# EAGLE schematic DC28_Jack-Attack_Badge-3 (EAGLE 9.5.1)
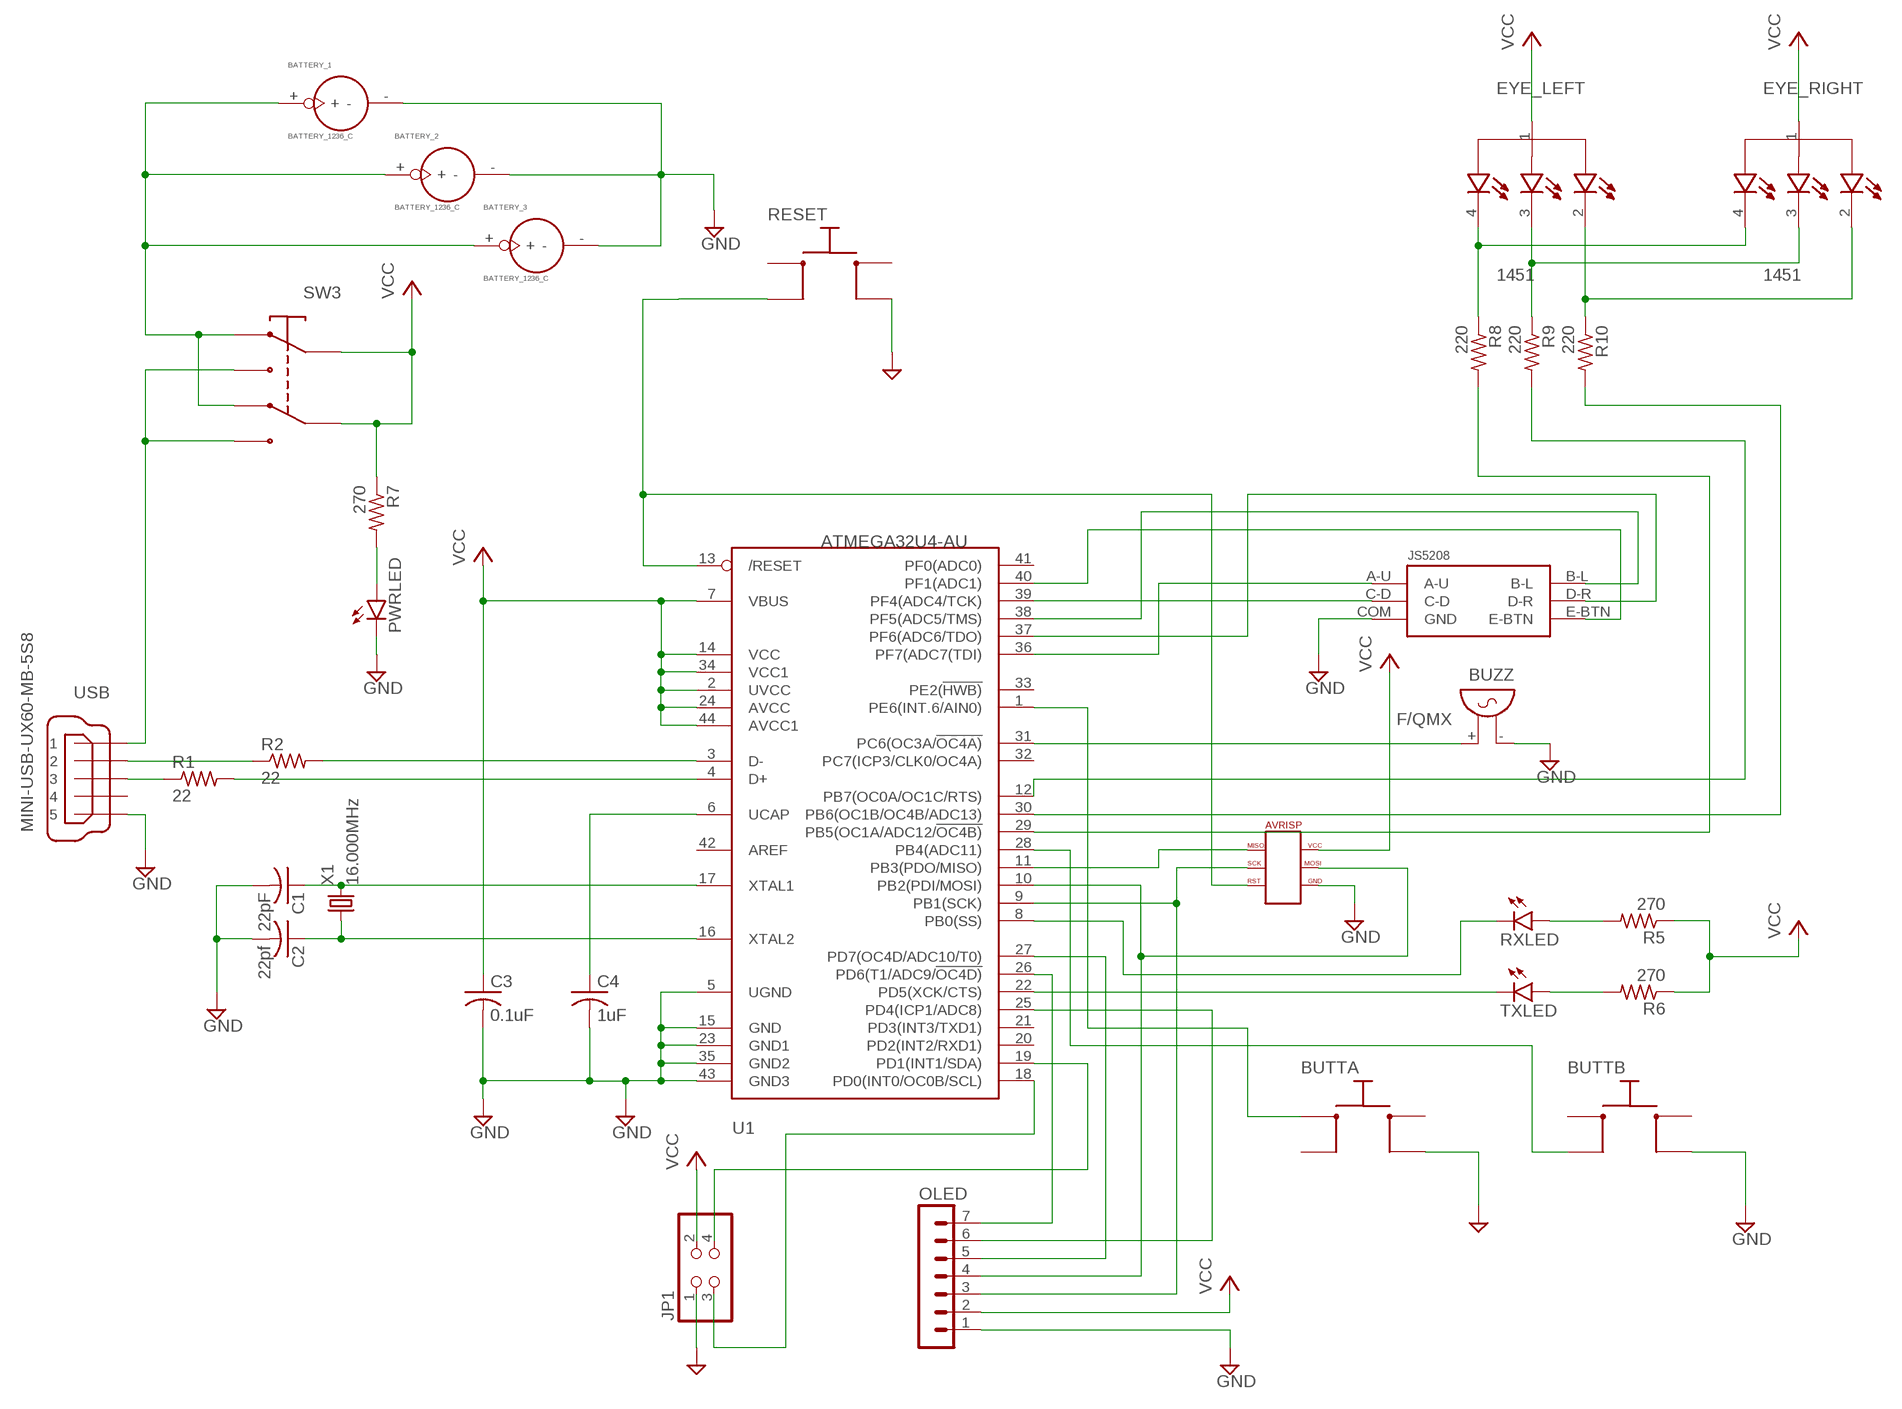
[diagram p0: schematic, sheet 1]

## Parts
BATTERY_1  BATTERY_1236_C  [BATTERY_1236_C]
BATTERY_2  BATTERY_1236_C  [BATTERY_1236_C]
BATTERY_3  BATTERY_1236_C  [BATTERY_1236_C]
BUTTA  PTS645  [PTS645_SMD]
BUTTB  PTS645  [PTS645_SMD]
BUZZ  F/QMX  [F/QMX]
C1  22pF  C-USC0805  [C0805]
C2  22pf  C-USC0805  [C0805]
C3  0.1uF  C-USC0805  [C0805]
C4  1uF  C-USC0805  [C0805]
EYE_LEFT  1451  [LED_1451]
EYE_RIGHT  1451  [LED_1451]
JP1  PINHD-2X2  [2X02]
OLED  MA07-1  [MA07-1]
PWRLED  LEDCHIP-LED0805  [CHIP-LED0805]
R1  22  R-US_R0805  [R0805]
R2  22  R-US_R0805  [R0805]
R5  270  R-US_R0805  [R0805]
R6  270  R-US_R0805  [R0805]
R7  270  R-US_R0805  [R0805]
R8  220  R-US_R0805  [R0805]
R9  220  R-US_R0805  [R0805]
R10  220  R-US_R0805  [R0805]
RESET  PTS645  [PTS645_SMD]
RXLED  LEDCHIP-LED0805  [CHIP-LED0805]
SW3  JS202011AQN  [JS202011AQN]
TXLED  LEDCHIP-LED0805  [CHIP-LED0805]
U1  ATMEGA32U4-AU  [TQFP44]
U$1  AVRISP_POGO  [AVRISP_POGO]
U$2  JS5208  [JS5208_PKG]
USB  MINI-USB-UX60-MB-5S8  [UX60-MB-5S8]
X1  16.000MHz  CSM-7X-DU  [CSM-7X-DU]

## Nets
BATT1: BATTERY_1.+ BATTERY_2.+ BATTERY_3.+ SW3.P$1 SW3.P$4
GND: BATTERY_1.- BATTERY_2.- BATTERY_3.- BUTTA.P$4 BUTTB.P$4 BUZZ.- C1.2 C2.2 C3.2 C4.2 JP1.1 OLED.1 PWRLED.C RESET.P$4 U1.5(UGND) U1.15(GND) U1.23(GND1) U1.35(GND2) U1.43(GND3) U$1.P$6 U$1.P$6B U$2.COM(GND) USB.5
N$1: R1.1 USB.3
N$2: R2.2 U1.3(D-)
N$3: R2.1 USB.2
N$4: R1.2 U1.4(D+)
N$5: C4.1 U1.6(UCAP)
N$6: BUTTA.P$1 U1.1(PE6(INT.6/AIN0))
N$7: C2.1 U1.16(XTAL2) X1.1
N$8: C1.1 U1.17(XTAL1) X1.2
N$9: U1.36(PF7(ADC7(TDI)) U$2.A-U
N$10: U1.11(PB3(PDO/MISO)) U$1.P$1 U$1.P$1B
N$11: OLED.3 U1.9(PB1(SCK)) U$1.P$3 U$1.P$3B
N$12: OLED.4 U1.10(PB2(PDI/MOSI)) U$1.P$4 U$1.P$4B
N$13: U1.37(PF6(ADC6/TDO)) U$2.D-R
N$14: BUTTB.P$2 U1.28(PB4(ADC11))
N$15: RESET.P$2 U1.13(/RESET) U$1.P$5 U$1.P$5B
N$16: BUZZ.+ U1.31(PC6(OC3A/!OC4A))
N$17: TXLED.C U1.22(PD5(XCK/CTS))
N$18: U1.38(PF5(ADC5/TMS)) U$2.B-L
N$19: U1.39(PF4(ADC4/TCK)) U$2.C-D
N$20: R6.2 TXLED.A
N$21: RXLED.C U1.8(PB0(SS))
N$22: R5.2 RXLED.A
N$23: U1.40(PF1(ADC1)) U$2.E-BTN
N$24: PWRLED.A R7.2
N$25: OLED.5 U1.27(PD7(OC4D/ADC10/T0))
N$26: OLED.6 U1.25(PD4(ICP1/ADC8))
N$27: JP1.4 U1.19(PD1(INT1/SDA))
N$28: JP1.3 U1.18(PD0(INT0/OC0B/SCL))
N$29: OLED.7 U1.26(PD6(T1/ADC9/!OC4D))
N$30: R10.2 U1.30(PB6(OC1B/OC4B/ADC13))
N$31: R8.2 U1.29(PB5(OC1A/ADC12/!OC4B))
N$33: EYE_LEFT.4 EYE_RIGHT.4 R8.1
N$34: R9.2 U1.12(PB7(OC0A/OC1C/RTS))
N$36: EYE_LEFT.3 EYE_RIGHT.3 R9.1
N$37: EYE_LEFT.2 EYE_RIGHT.2 R10.1
USB+5V: SW3.P$3 SW3.P$6 USB.1
VCC: C3.1 EYE_LEFT.1 EYE_RIGHT.1 JP1.2 OLED.2 R5.1 R6.1 R7.1 SW3.P$2 SW3.P$5 U1.2(UVCC) U1.7(VBUS) U1.14(VCC) U1.24(AVCC) U1.34(VCC1) U1.44(AVCC1) U$1.P$2 U$1.P$2B
Unconnected: BUTTA.P$2 BUTTA.P$3 BUTTB.P$1 BUTTB.P$3 RESET.P$1 RESET.P$3 U1.20(PD2(INT2/RXD1)) U1.21(PD3(INT3/TXD1)) U1.32(PC7(ICP3/CLK0/OC4A)) U1.33(PE2(!HWB)) U1.41(PF0(ADC0)) U1.42(AREF) USB.4

## Library data of the parts
BATTERY_1-BATTERY_3 = Itead_BP_110825:BATTERY_1236_C: SOC004
BUTTA BUTTB RESET = macetech:PTS645
BUZZ = buzzer:F/QMX: BUZZER Source: Buerklin; OC_FARNELL: unknown; OC_NEWARK: unknown
C1-C4 = rcl:C-US: CAPACITOR, American symbol
EYE_LEFT EYE_RIGHT = 1451:1451: Diffused 'Piranha' Super-flux RGB (tri-color) LED (10 pack); AVAILABILITY: Unavailable; DESCRIPTION: Diffused 'Piranha' Super-flux RGB _tri-color_ LED _10 pack_; MF: Adafruit Industries; MP: 1451; PACKAGE: DIP-4 Adafruit Industries; PRICE: None
JP1 = pinhead:PINHD-2X2: PIN HEADER
OLED = con-lstb:MA07-1: PIN HEADER; OC_FARNELL: unknown; OC_NEWARK: unknown
PWRLED RXLED TXLED = led:LED: LED OSRAM: - CHIPLED LG R971, LG N971, LY N971, LG Q971, LY Q971, LO R971, LY R971 LH N974, LH R974 LS Q976, LO Q976, LY Q976 LO Q996 - Hyper CHIPLED LW Q18S LB Q993, LB Q99A, LB R99A - SideLED LS A670, LO A670, LY A670, LG A670, LP A670 LB A673, LV A673, LT A673, LW A673 LH A674 LY A675 LS A676, LA A676, LO A676, LY A676, LW A676 LS A679, LY A679, LG A679 - Hyper Micro SIDELED® LS Y876, LA Y876, LO Y876, LY Y876 LT Y87S - SmartLED LW L88C, LW L88S LB L89C, LB L89S, LG L890 LS L89K, LO L89K, LY L89K LS L896, LA L896, LO L896, LY L896 - TOPLED LS T670, LO T670, LY T670, LG T670, LP T670 LSG T670, LSP T670, LSY T670, LOP T670, LYG T670 LG T671, LOG T671, LSG T671 LB T673, LV T673, LT T673, LW T673 LH T674 LS T676, LA T676, LO T676, LY T676, LB T676, LH T676, LSB T676, LW T676 LB T67C, LV T67C, LT T67C, LS T67K, LO T67K, LY T67K, LW E67C LS E67B, LA E67B, LO E67B, LY E67B, LB E67C, LV E67C, LT E67C LW T67C LS T679, LY T679, LG T679 LS T770, LO T770, LY T770, LG T770, LP T770 LB T773, LV T773, LT T773, LW T773 LH T774 LS E675, LA E675, LY E675, LS T675 LS T776, LA T776, LO T776, LY T776, LB T776 LHGB T686 LT T68C, LB T68C - Hyper Mini TOPLED® LB M676 - Mini TOPLED Santana® LG M470 LS M47K, LO M47K, LY M47K Source: http://www.osram.convergy.de LUXEON: - LUMILED® LXK2-PW12-R00, LXK2-PW12-S00, LXK2-PW14-U00, LXK2-PW14-V00 LXK2-PM12-R00, LXK2-PM12-S00, LXK2-PM14-U00 LXK2-PE12-Q00, LXK2-PE12-R00, LXK2-PE12-S00, LXK2-PE14-T00, LXK2-PE14-U00 LXK2-PB12-K00, LXK2-PB12-L00, LXK2-PB12-M00, LXK2-PB14-N00, LXK2-PB14-P00, LXK2-PB14-Q00 LXK2-PR12-L00, LXK2-PR12-M00, LXK2-PR14-Q00, LXK2-PR14-R00 LXK2-PD12-Q00, LXK2-PD12-R00, LXK2-PD12-S00 LXK2-PH12-R00, LXK2-PH12-S00 LXK2-PL12-P00, LXK2-PL12-Q00, LXK2-PL12-R00 Source: www.luxeon.com KINGBRIGHT: KA-3528ASYC Source: www.kingbright.com
R1 R2 R5-R10 = rcl:R-US_: RESISTOR, American symbol
SW3 = macetech:JS202011AQN
U1 = adafruit:ATMEGA32U4: http://www.ladyada.net/library/eagle
U$1 = macetech:AVRISP_POGO
U$2 = JS5208:JS5208; AVAILABILITY: Unavailable; DESCRIPTION: JS Series 20 mA Gull Wing Silver Contact Navigation Switch; MF: E-Switch; MP: JS5208; PACKAGE: None; PRICE: None
USB = con-hirose:MINI-USB-: MINI USB Connector Source: http://www.hirose.co.jp/cataloge_hp/e24000019.pdf; OC_FARNELL: unknown; OC_NEWARK: unknown
X1 = crystal:CSM-7X-DU: SMD CRYSTAL Source: www.ecsxtal.com .. Crystal 3.6864MHz CSM_7X_DU.PDF; OC_FARNELL: unknown; OC_NEWARK: unknown